# EAGLE design dsky_md_4.01v (EAGLE 6.5.0)
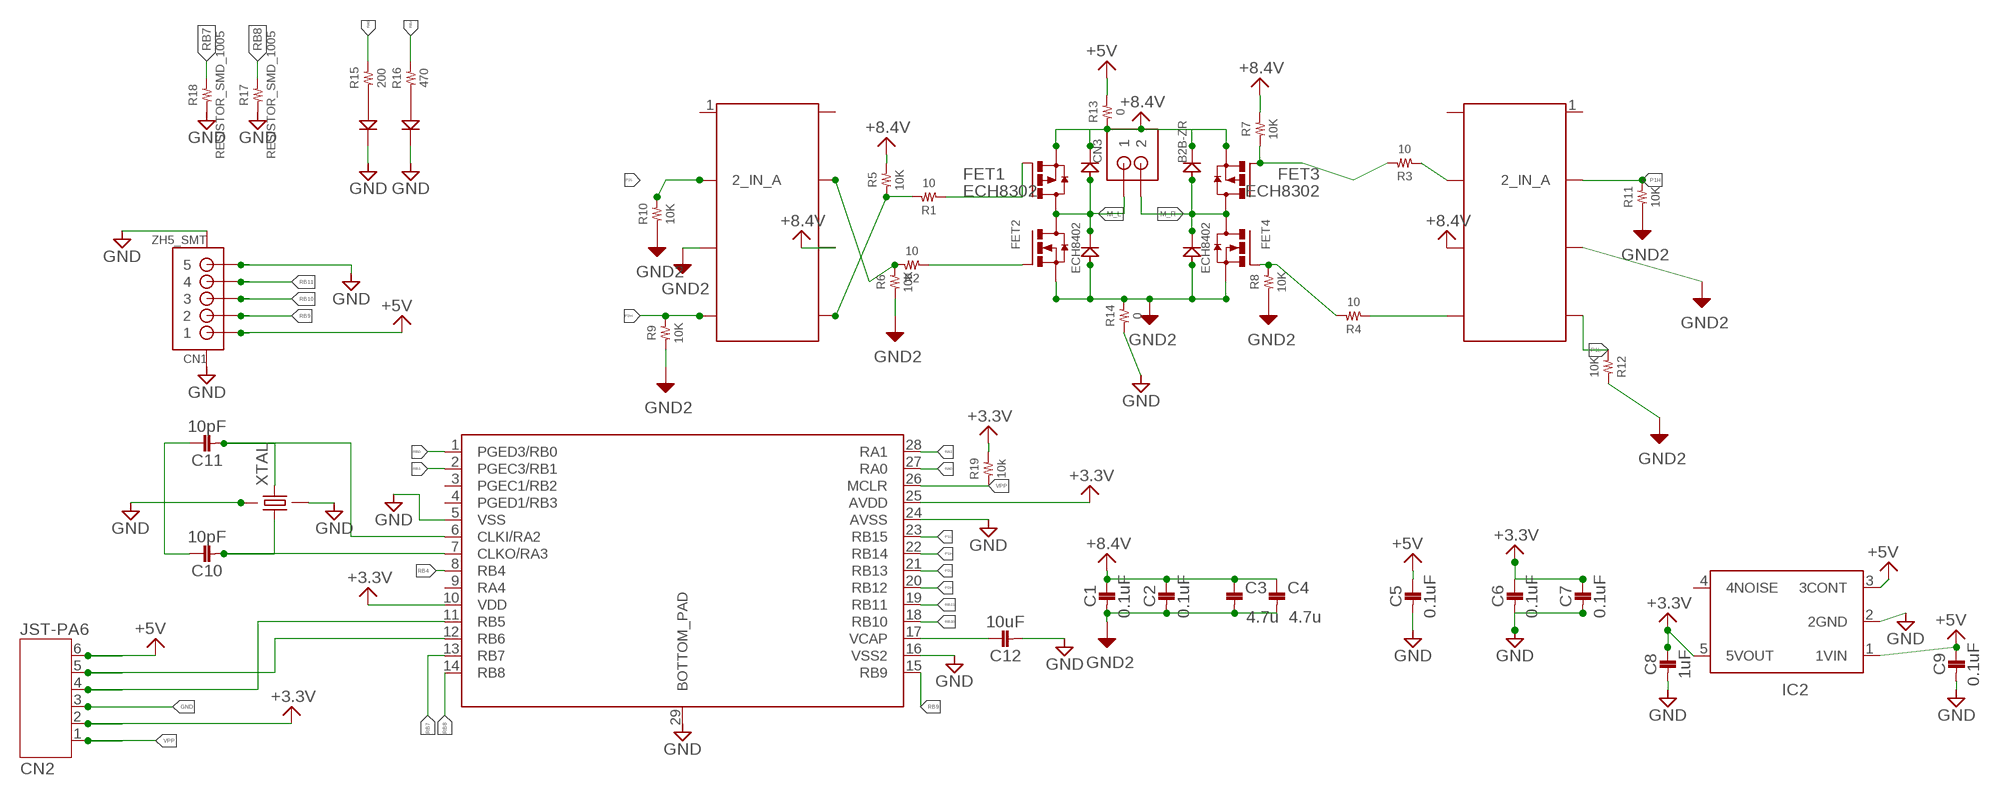
[diagram p0: schematic, sheet 1]

## Parts
C1  0.1uF  1608  [1608]
C2  0.1uF  1608  [1608]
C3  4.7u  2012  [2012]
C4  4.7u  2012  [2012]
C5  0.1uF  1608  [1608]
C6  0.1uF  1608  [1608]
C7  0.1uF  1608  [1608]
C8  1uF  1608  [1608]
C9  0.1uF  1608  [1608]
C10  10pF  1608  [1608]
C11  10pF  1608  [1608]
C12  10uF  1608  [1608]
CN1  ZH5_SMT  [ZH5_SMT]
CN2  JST-PA6  [JST-PA6]
CN3  B2B-ZR  [B2B-ZR]
D1  SS2040  [SOD-123FL]
D2  SS2040  [SOD-123FL]
D3  SS2040  [SOD-123FL]
D4  SS2040  [SOD-123FL]
FET1  ECH8302  ECH83  [ECH8]
FET2  ECH8402  ECH84  [ECH8]
FET3  ECH8302  ECH83  [ECH8]
FET4  ECH8402  ECH84  [ECH8]
IC1  DSPIC33EP32MC202  [QFN-S28_6X6MC]
IC2  NJM2866F33  TAR5SB  [SSOP5-P-0.95]
IC3  TC1427COA  [SOIC8]
IC4  TC1427COA  [SOIC8]
LED1  1608  [1608]
LED2  1608  [1608]
R1  10  RESISTOR__SMD  [1608]
R2  10  RESISTOR__SMD  [1608]
R3  10  RESISTOR__SMD  [1608]
R4  10  RESISTOR__SMD  [1608]
R5  10K  RESISTOR__SMD  [1608]
R6  10K  RESISTOR__SMD  [1608]
R7  10K  RESISTOR__SMD  [1608]
R8  10K  RESISTOR__SMD  [1608]
R9  10K  RESISTOR__SMD  [1608]
R10  10K  RESISTOR__SMD  [1608]
R11  10K  RESISTOR__SMD  [1608]
R12  10K  RESISTOR__SMD  [1608]
R13  0  RESISTOR__SMD  [1608]
R14  0  RESISTOR__SMD  [1608]
R15  200  RESISTOR__SMD  [1608]
R16  470  RESISTOR__SMD  [1608]
R17  RESISTOR_SMD_1005  [1005]
R18  RESISTOR_SMD_1005  [1005]
R19  10k  RESISTOR__SMD  [1608]
XTAL  X22  [SMD_X22]

## Nets
+3.3V: C6.P$1 C7.P$1 C8.P$1 CN2.2 IC1.10(VDD) IC1.25(AVDD) IC2.5(5VOUT) R19.2
+5V: C5.P$1 C9.P$1 CN1.P1 CN2.6 IC2.1(1VIN) IC2.3(3CONT) R13.2
+8.4V: C1.P$1 C2.P$1 C3.1 C4.1 D1.2(PK) D3.2(PK) FET1.1(S) FET1.2(S) FET1.3(S) FET3.1(S) FET3.2(S) FET3.3(S) IC3.6(6_VDD) IC4.6(6_VDD) R5.2 R7.2 R13.1
GND: C5.P$2 C6.P$2 C7.P$2 C8.P$2 C9.P$2 C10.P$1 C11.P$1 C12.P$2 CN1.G1(G_L) CN1.G2(G_R) CN1.P5 CN2.3 IC1.5(VSS) IC1.16(VSS2) IC1.24(AVSS) IC1.29(BOTTOM_PAD) IC2.2(2GND) LED1.2(K) LED2.2(K) R14.1 R17.1 R18.1 XTAL.2 XTAL.4
GND2: C1.P$2 C2.P$2 C3.2 C4.2 D2.1(PA) D4.1(PA) FET2.1(S) FET2.2(S) FET2.3(S) FET4.1(S) FET4.2(S) FET4.3(S) IC3.3(3_GND) IC4.3(3_GND) R6.1 R8.1 R9.1 R10.1 R11.1 R12.2 R14.2
M_L: CN3.1 D1.1(PA) D2.2(PK) FET1.5(D) FET1.6(D) FET1.7(D) FET1.8(D) FET2.5(D) FET2.6(D) FET2.7(D) FET2.8(D)
M_R: CN3.2 D3.1(PA) D4.2(PK) FET3.5(D) FET3.6(D) FET3.7(D) FET3.8(D) FET4.5(D) FET4.6(D) FET4.7(D) FET4.8(D)
N$1: FET1.4(G) R1.1
N$2: FET2.4(G) R2.1
N$3: IC3.5(5_OUT_B) R1.2 R5.1
N$4: FET3.4(G) R3.2 R7.1
N$5: IC3.7(7_OUT_A) R2.2 R6.2
N$6: IC4.5(5_OUT_B) R4.1
N$7: C12.P$1 IC1.17(VCAP)
N$8: C10.P$2 IC1.7(CLKO/RA3) XTAL.1
N$9: IC4.7(7_OUT_A) R3.1
N$10: CN2.4 IC1.11(RB5)
N$11: CN2.5 IC1.12(RB6)
N$12: FET4.4(G) R4.2 R8.2
N$13: C11.P$2 IC1.6(CLKI/RA2) XTAL.3
N$14: LED1.1(A) R15.1
N$16: LED2.1(A) R16.1
P1H: IC1.22(RB14) IC4.2(2_IN_A) R11.2
P1L: IC1.23(RB15) IC4.4(4_IN_B) R12.1
P2H: IC1.20(RB12) IC3.4(4_IN_B) R9.2
P2L: IC1.21(RB13) IC3.2(2_IN_A) R10.2
RA0: IC1.27(RA0) R15.2
RA1: IC1.28(RA1)
RB0: IC1.1(PGED3/RB0)
RB1: IC1.2(PGEC3/RB1)
RB4: IC1.8(RB4) R16.2
RB7: IC1.13(RB7) R18.2
RB8: IC1.14(RB8) R17.2
RB9: CN1.P2 IC1.15(RB9)
RB10: CN1.P3 IC1.18(RB10)
RB11: CN1.P4 IC1.19(RB11)
VPP: CN2.1 IC1.26(MCLR) R19.1
Unconnected: IC1.3(PGEC1/RB2) IC1.4(PGED1/RB3) IC1.9(RA4) IC2.4(4NOISE) IC3.1(1_NC) IC3.8(8_NC) IC4.1(1_NC) IC4.8(8_NC)

## Library data of the parts
C1 C2 C5-C12 = 02_C:1608
C3 C4 = 02_C:2012
CN1 = 14_JST:ZH5_SMT
CN2 = jst-ph:JST-PA6
CN3 = jst:B2B-ZR
D1-D4 = DIODE:SS2040
FET1 FET3 = 06_FET:ECH83
FET2 FET4 = 06_FET:ECH84
IC1 = microchip-dspic:DSPIC33EP32MC202
IC2 = 04_IC:TAR5SB
IC3 IC4 = 04_IC:TC1427COA
LED1 LED2 = 10_LED:1608
R1-R16 R19 = 01_R:RESISTOR__SMD
R17 R18 = 01_R:RESISTOR_SMD_1005
XTAL = 09_2_CRYSTAL:X22

## Board
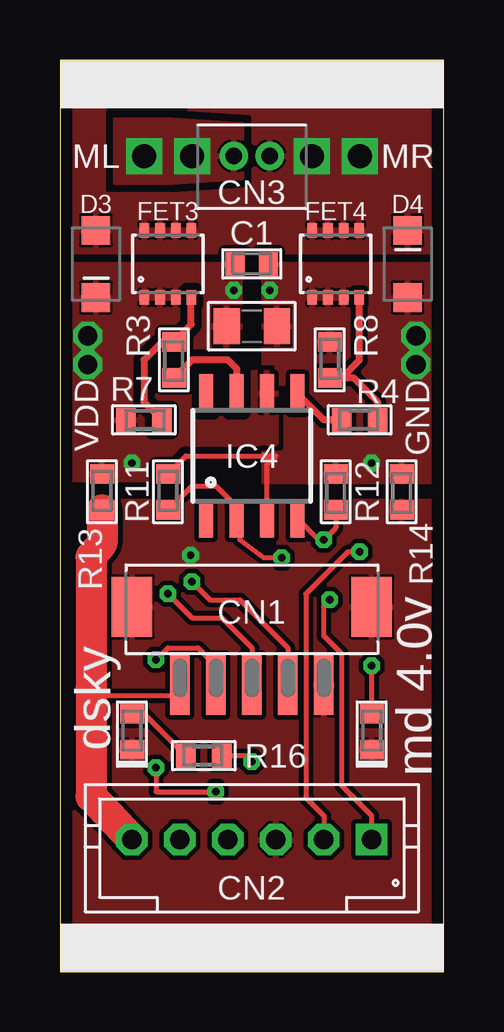
[diagram p1: board, top side]
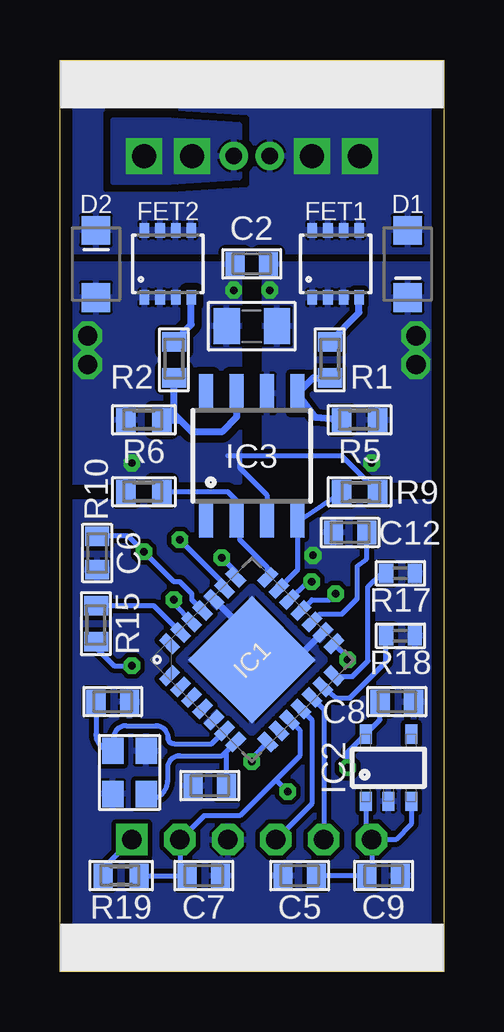
[diagram p2: board, bottom side, seen from below]

Size 16 x 38 mm. Coordinates in mm from the lower left corner, seen from the top.
Outline: 0,0 16,0 16,38 0,38 0,0
Copper layers (1*16): Top 0.035mm / dielectric 1.5mm / Bottom 0.035mm
Design rules "default *": minimum track width 6mil, minimum drill 0.3mm, track to track 6mil, track to pad 6mil, pad to pad 6mil, via to via 6mil, smd to smd 8mil, copper to edge 20mil, drill to drill 8mil, minimum pad ring 10mil, minimum via ring 8mil, stop-mask expansion 4mil, vias tented up to drill 0.4mm, thermal gap 0.1mm
bKeepout: area 0,0 to 16,2; area 0,36 to 16,38

### Footprints (pad centres in the part's own frame; a part is rotated, then mirrored left to right if it is on the bottom)
1608 = smd 0.8 x 1: P$1 -0.7,0; P$2 0.7,0
2012 = smd 1.1 x 1.5: 1 -1.05,0; 2 1.05,0
ZH5_SMT = smd 1.7 x 2.5: G1 -5,1.95; G2 5,1.95 | smd 0.8 x 2.5: P1 -3,-1.3; P2 -1.5,-1.3; P3 0,-1.3; P4 1.5,-1.3; P5 3,-1.3
JST-PA6 = drill 0.8 square: 1 5,0 | drill 0.8 octagon: 2 3,0; 3 1,0; 4 -1,0; 5 -3,0; 6 -5,0
B2B-ZR = drill 0.7 pad 1.1: 1 -0.75,0; 2 0.75,0
SOD-123FL = smd 1.2 x 1.2: 1 -1.4,0; 2 1.4,0
ECH8 = smd 0.4 x 0.6: 1 -0.975,-1.4; 2 -0.325,-1.4; 3 0.325,-1.4; 4 0.975,-1.4; 5 0.975,1.4; 6 0.325,1.4; 7 -0.325,1.4; 8 -0.975,1.4
QFN-S28_6X6MC = smd 0.813 x 0.432: 1 -2.896,1.956; 2 -2.896,1.295; 3 -2.896,0.66; 4 -2.896,0; 5 -2.896,-0.66; 6 -2.896,-1.295; 7 -2.896,-1.956; 15 2.896,-1.956; 16 2.896,-1.295; 17 2.896,-0.66; 18 2.896,0; 19 2.896,0.66; 20 2.896,1.295; 21 2.896,1.956 | smd 0.432 x 0.813: 8 -1.956,-2.896; 9 -1.295,-2.896; 10 -0.66,-2.896; 11 0,-2.896; 12 0.66,-2.896; 13 1.295,-2.896; 14 1.956,-2.896; 22 1.956,2.896; 23 1.295,2.896; 24 0.66,2.896; 25 0,2.896; 26 -0.66,2.896; 27 -1.295,2.896; 28 -1.956,2.896 | smd 3.75 x 3.75: 29 0,0
SSOP5-P-0.95 = smd 0.5 x 0.8: 1 -0.95,-1.4; 2 0,-1.4; 3 0.95,-1.4; 4 0.95,1.4; 5 -0.95,1.4
SOIC8 = smd 0.6 x 1.6: 1 -1.905,-2.6; 2 -0.635,-2.6; 3 0.635,-2.6; 4 1.905,-2.6; 5 1.905,2.6; 6 0.635,2.6; 7 -0.635,2.6; 8 -1.905,2.6
1608' = smd 0.8 x 1: 1 -0.75,0; 2 0.75,0
1005 = smd 0.6 x 0.8: 1 -0.6,0; 2 0.6,0
SMD_X22 = smd 1.1 x 0.9: 1 -0.9,-0.7; 2 0.9,-0.7; 3 0.9,0.7; 4 -0.9,0.7

### Placement (x,y rotation side)
C1  8,29.5 0 top
C2  8,29.5 180 bottom
C3  8,26.9 180 bottom
C4  8,26.9 0 top
C5  6,4 180 bottom
C6  14.45,17.45 270 bottom
C7  10,4 0 bottom
C8  1.95,11.25 0 bottom
C9  2.5,4 0 bottom
C10  9.75,7.75 0 bottom
C11  13.8,11.25 180 bottom
C12  3.9,18.3 180 bottom
CN1  8,13.25 0 top
CN2  8,5.5 0 top
CN3  8,34 0 top
D1  1.5,29.5 270 bottom
D2  14.5,29.5 90 bottom
D3  1.5,29.5 270 top
D4  14.5,29.5 90 top
DRILEGEND  [DRILEGEND]  -12.75,-10.91 0 top  (outside the outline)
FET1  4.5,29.5 0 bottom
FET2  11.5,29.5 0 bottom
FET3  4.5,29.5 0 top
FET4  11.5,29.5 0 top
IC1  8,13 45 bottom
IC2  2.3,8.5 0 bottom
IC3  8,21.5 0 bottom
IC4  8,21.5 0 top
LED1  1608  [1608']  13,10 270 top
LED2  1608  [1608']  3,10 270 top
R1  10  [1608']  4.75,25.5 270 bottom
R2  10  [1608']  11.25,25.5 270 bottom
R3  10  [1608']  4.75,25.5 90 top
R4  10  [1608']  12.5,23 0 top
R5  10K  [1608']  3.5,23 0 bottom
R6  10K  [1608']  12.5,23 0 bottom
R7  10K  [1608']  3.5,23 180 top
R8  10K  [1608']  11.25,25.5 270 top
R9  10K  [1608']  3.5,20 180 bottom
R10  10K  [1608']  12.5,20 0 bottom
R11  10K  [1608']  4.5,20 270 top
R12  10K  [1608']  11.5,20 90 top
R13  0  [1608']  1.75,20 270 top
R14  0  [1608']  14.25,20 90 top
R15  200  [1608']  14.5,14.5 90 bottom
R16  470  [1608']  6,9 0 top
R17  1.8,16.6 180 bottom
R18  1.8,14 180 bottom
R19  10k  [1608']  13.45,4 0 bottom
XTAL  13.1,8.3 90 bottom

### Tracks (layer width: path | path; a pad name or v marks a point on that pad's centre or on a via)
+3.3V  (via drill 0.3)
  Top 0.2: v12.5,17.5 12,17.5 10.25,15.75 10.25,7.25 11,6.5 CN2.2 | v4,8.5 4,7.5 v6.5,7.5
  Bottom 0.2: IC1.10 6,10.07 6,9 7,8 | 7,8 8.5,6.5 10,6.5 CN2.2 11,4 | R19.2 11,4 | 11,4 C7.P$1 | IC1.25 | IC1.25 10.5,15.5 10.5,15.75 11,16.25 11.25,16.25 | v6.5,7.5 7,8 | 11.25,16.25 | 11.25,16.25 v12.5,17.5 13.15,18.15 C6.P$1 | C8.P$1 2.65,10.5 IC2.5 4,9.15 v4,8.5
+5V
  Top 0.2: CN1.P1 5,11.5 1.5,11.5 1.3,11.8
  Top 1.3: R13.2 1.75,17.85 1.3,17.3 1.3,11.8 1.3,7.3 CN2.6
  Bottom 0.2: CN2.6 3,3.7 C9.P$1 C5.P$1 | IC2.3 1.35,6.15 2,5.5 CN2.6 | IC2.1 3.25,5.75 CN2.6
+8.4V  (via drill 0.3, 0.8)
  other vias: 1.15,25.3 1.15,26.5 7.25,28.4 3,21.2
  pour Top (isolate 0.3): 0,29.5 7.5,29.5 7.5,25 9,25 9,22 7.5,22 7.5,20.5 0,20.5
  pour Bottom (isolate 0.2): 0,29.5 7.5,29.5 7.5,20.5 0,20.5
GND  (via drill 0.3)
  Bottom 0.3: IC1.24 8,13.93 IC1.29 6.17,13 IC1.16
  other vias: 5.45,17.35
  pour Top (isolate 0.2): 0,0 16,0 16,19.6 3,19.6 2.4,19.6 0,19.6
  pour Bottom (isolate 0.2): 0,0 16,0 16,19.6 0,19.6
GND2  (via drill 0.3, 0.8)
  Top 0.2: R11.1 5.25,21.5 8.5,21.5 9,21.5 8.63,21.14 IC4.3
  Top 0.3: 8.63,21.36 8.5,21.5
  Bottom 0.2: IC3.3 7.37,19.86 8.5,21 8.5,21.5 | R9.1 4.25,21.5 8.5,21.5 | 8.5,21.5 9,21.5
  other vias: 14.85,25.3 14.85,26.5 8.75,28.4 13,21.2
  pour Top (isolate 0.2, rank 2): 8.5,29.5 16,29.5 16,20.4 8.5,20.4
  pour Bottom (isolate 0.3): 8.5,29.5 16,29.5 16,20.4 8.5,20.4
M_L  (via drill 1)
  other vias: 5.5,34 3.5,34
  pour Bottom (isolate 0.3, rank 2): 0,35.9 16,35.9 16,30 0,30
  pour Top: 2.3,35.5 2.3,32.9 4.7,32.9 7.6,33.1 7.6,35.3 4.7,35.5
M_R  (via drill 1)
  other vias: 10.5,34 12.5,34
  pour Top (isolate 0.3, rank 2): 0,35.9 16,35.9 16,30 0,30
  pour Bottom: 8.5,35.3 11.4,35.5 13.8,35.5 13.8,32.9 11.4,32.9 8.5,33.1
N$1
  Bottom 0.3: R1.1 3.52,27.48 FET1.4
N$2
  Bottom 0.3: R2.1 10.53,26.98 FET2.4
N$3
  Bottom 0.3: R1.2 5.45,24.75 IC3.5 5.35,23.1 R5.1
N$4
  Top 0.3: FET3.4 5.47,26.98 R3.2 4.25,26.25 3.5,25.5 3.5,23.75 R7.1
N$5
  Bottom 0.3: IC3.7 8.63,23.11 9.25,22.5 10.5,22.5 11,23 | 11,23 11.25,23.25 R2.2 | R6.2 11,23
N$6
  Top 0.3: R4.1 11.01,23 IC4.5
N$7
  Bottom 0.2: IC1.17 5.17,14.9 4.25,14.9 3.6,15.55 3.6,16.9 3.2,17.2 C12.P$1
N$8
  Bottom 0.2: XTAL.1 12.35,7.15 arc-90 11.5,8 11.5,8.5 arc90 11,9 9.23,9 IC1.7 9.05,9.18 C10.P$2
N$9
  Top 0.3: R3.1 5.5,25.5 7,25.5 7.37,25.14 IC4.7
N$10
  Bottom 0.2: IC1.11 5.5,10.5 5.5,7 CN2.4
N$11
  Bottom 0.2: IC1.12 5,10.93 CN2.5
N$12
  Top 0.3: FET4.4 12.47,25.48 11.75,24.75 R8.2 12.25,24.75 13.25,23.75 R4.2
N$13
  Bottom 0.2: 13.8,9.45 XTAL.3 | C11.P$2 14.5,9.9 arc-90 XTAL.3 | XTAL.3 13.75,9.25 13.75,9.75 arc90 13.25,10.25 12,10.25 arc90 11.5,9.75 arc-90 11.25,9.5 9.67,9.5 IC1.6
N$14  (via drill 0.3)
  Top 0.2: LED1.1 v13,12.75
  Bottom 0.2: R15.1 14.75,13.75 13.75,12.75 v13,12.75
N$16
  Top 0.2: LED2.1 3.5,10.75 R16.1
P1H  (via drill 0.3)
  Top 0.2: v9.25,17.25 8.5,17.25 7.5,18 7.5,18.5 | 7.5,18.5 7.5,18.77 | R11.2 5.5,20.25 6.5,20.25 7.37,19.39 IC4.2 7.37,18.64 7.5,18.5
  Bottom 0.2: IC1.22 8.66,16.66 v9.25,17.25
P1L  (via drill 0.3)
  Top 0.2: R12.1 11.5,18.5 v11,18 10.8,18 IC4.4
  Bottom 0.2: IC1.23 9.13,16.13 v11,18
P2H
  Bottom 0.2: IC1.20 6.09,16.74 IC3.4 5.85,18.9 R9.2
P2L
  Bottom 0.2: IC1.21 7.33,16.84 8.5,18 8.5,18.77 IC3.2 8.63,19.64 9,20 R10.2
RA0
  Bottom 0.2: IC1.27 12.08,15.25 R15.2
RB4  (via drill 0.3)
  Top 0.2: v8,8.75 7.75,9 R16.2
  Bottom 0.2: IC1.8 8,8.9 v8,8.75
RB7
  Bottom 0.2: IC1.13 4.47,11.4 3.9,11.4 2.4,12.9 R18.2
RB8
  Bottom 0.2: IC1.14 4.53,12.3 3.8,12.3 3.15,12.95 3.15,16.05 2.6,16.6 R17.2
RB9  (via drill 0.3)
  Top 0.2: v4,13 4.5,13.5 5.75,13.5 6.5,12.75 CN1.P2
  Bottom 0.2: IC1.15 4,13.1 v4,13
RB10  (via drill 0.3)
  Top 0.2: v4.5,15.75 5.5,14.75 6.75,14.75 8,13.5 CN1.P3
  Bottom 0.2: IC1.18 5.5,15.5 4.75,15.5 v4.5,15.75
RB11  (via drill 0.3)
  Top 0.2: v5.5,16.25 6.25,15.5 7.5,15.5 9.5,13.5 CN1.P4
  Bottom 0.2: IC1.19 5.68,16.25 v5.5,16.25
VPP  (via drill 0.3)
  Top 0.2: v11.25,15.5 11,15.25 11,14 11.75,13.25 11.75,7.75 13,6.5 CN2.1
  Bottom 0.2: CN2.1 14.2,4.3 R19.1 | v11.25,15.5 11.25,15.32 IC1.26

### Text on the board
tPlace: ML | MR | VDD | GND | md 4.0v | dsky
DrillLegend: 穴図